# Altium schematic sheet Effects_Sch.SchDoc
size A
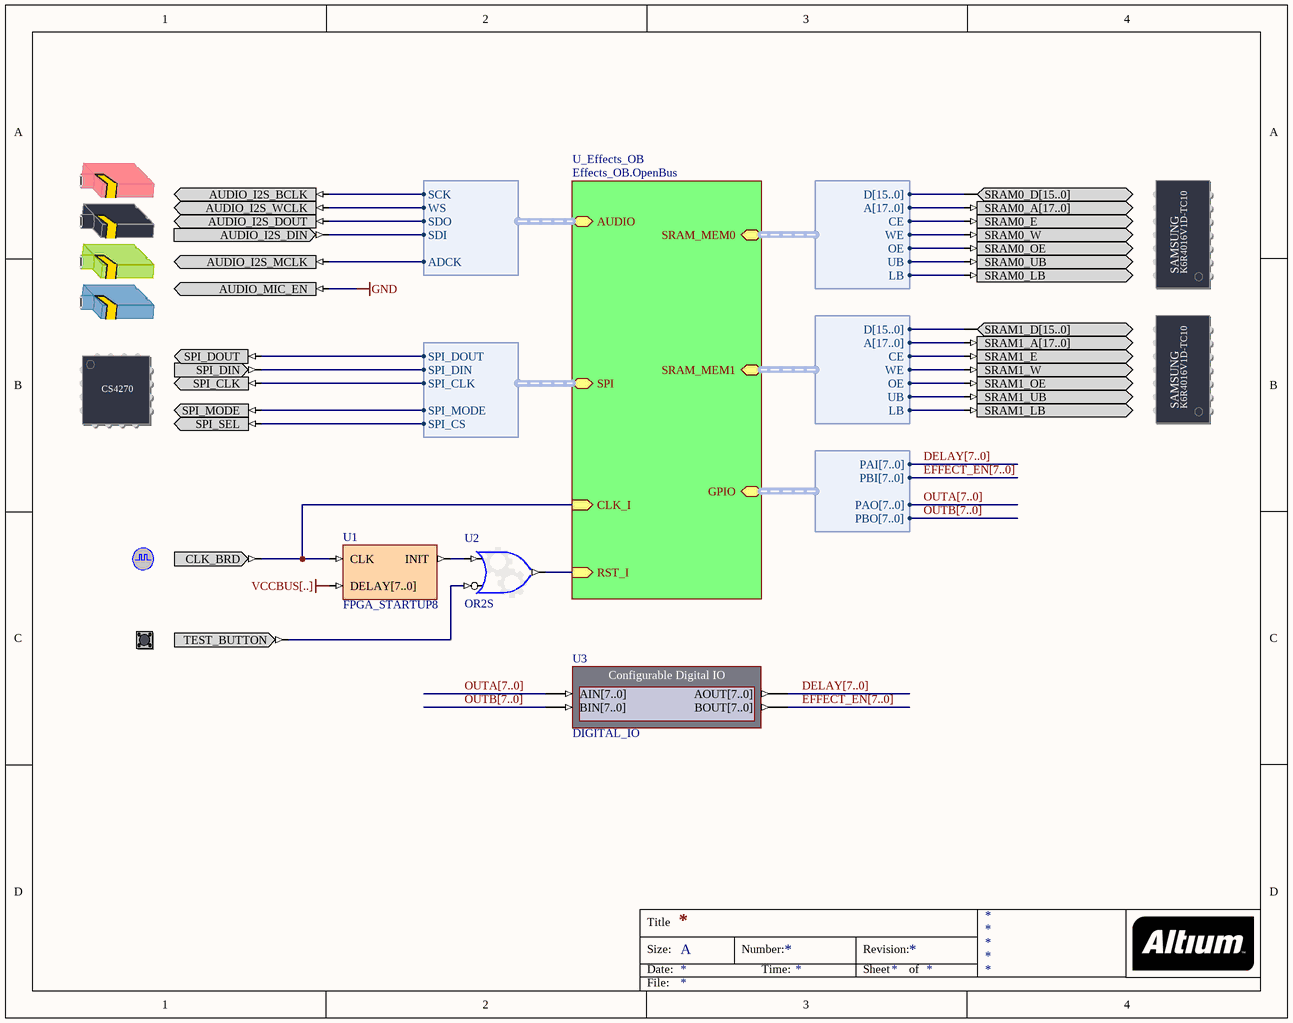
[diagram p0: Effects_Sch.SchDoc]

## Parts
(Parts that share a designator on the sheet are numbered #1, #2 ... from top to bottom, then left to right.)
?#1  AUDIO_CODEC  (value not drawn)
?#2  SRAM_DAUGHTER0  (value not drawn)
?#3  SRAM_DAUGHTER1  (value not drawn)
?#4  AUDIO_CODEC_CTRL  (value not drawn)
?#5  CLOCK_BOARD  (value not drawn)
?#6  TEST_BUTTON  (value not drawn)
U1  FPGA_STARTUP8
U2  OR2S
U3  DIGITAL_IO

## Sub-sheets
U_Effects_OB = Effects_OB.OpenBus: RST_I (in), CLK_I (in), GPIO (harness WB_PRTIO_IO_2_2), AUDIO (harness I2S_W_Both), SPI (harness SPI_W_NB), SRAM_MEM0 (harness WB_MEM_CTRL_SRAM16_A18), SRAM_MEM1 (harness WB_MEM_CTRL_SRAM16_A18)

## Harnesses
I2S_W_Both: SCK, WS, SDO, SDI, ADCK
SPI_W_NB: SPI_DOUT, SPI_DIN, SPI_CLK, SPI_MODE, SPI_CS
WB_PRTIO_IO_2_2: PAO[7..0], PAI[7..0], PBO[7..0], PBI[7..0]
WB_MEM_CTRL_SRAM16_A18: D[15..0], A[17..0], CE, WE, OE, UB, LB

## Nets
GND: ?#1.AUDIO_MIC_EN
VCCBUS[..]: U1.DELAY[7..0]
DELAY[7..0]: U3.AOUT[7..0] ; sheet U_Effects_OB/GPIO.PAI[7..0]
EFFECT_EN[7..0]: U3.BOUT[7..0] ; sheet U_Effects_OB/GPIO.PBI[7..0]
OUTA[7..0]: U3.AIN[7..0] ; sheet U_Effects_OB/GPIO.PAO[7..0]
OUTB[7..0]: U3.BIN[7..0] ; sheet U_Effects_OB/GPIO.PBO[7..0]
Net?#1_AUDIO_I2S_BCLK: ?#1.AUDIO_I2S_BCLK ; sheet U_Effects_OB/AUDIO.SCK
Net?#1_AUDIO_I2S_DIN: ?#1.AUDIO_I2S_DIN ; sheet U_Effects_OB/AUDIO.SDI
Net?#1_AUDIO_I2S_DOUT: ?#1.AUDIO_I2S_DOUT ; sheet U_Effects_OB/AUDIO.SDO
Net?#1_AUDIO_I2S_MCLK: ?#1.AUDIO_I2S_MCLK ; sheet U_Effects_OB/AUDIO.ADCK
Net?#1_AUDIO_I2S_WCLK: ?#1.AUDIO_I2S_WCLK ; sheet U_Effects_OB/AUDIO.WS
Net?#2_SRAM0_A[17..0]: ?#2.SRAM0_A[17..0] ; sheet U_Effects_OB/SRAM_MEM0.A[17..0]
Net?#2_SRAM0_D[15..0]: ?#2.SRAM0_D[15..0] ; sheet U_Effects_OB/SRAM_MEM0.D[15..0]
Net?#2_SRAM0_E: ?#2.SRAM0_E ; sheet U_Effects_OB/SRAM_MEM0.CE
Net?#2_SRAM0_LB: ?#2.SRAM0_LB ; sheet U_Effects_OB/SRAM_MEM0.LB
Net?#2_SRAM0_OE: ?#2.SRAM0_OE ; sheet U_Effects_OB/SRAM_MEM0.OE
Net?#2_SRAM0_UB: ?#2.SRAM0_UB ; sheet U_Effects_OB/SRAM_MEM0.UB
Net?#2_SRAM0_W: ?#2.SRAM0_W ; sheet U_Effects_OB/SRAM_MEM0.WE
Net?#3_SRAM1_A[17..0]: ?#3.SRAM1_A[17..0] ; sheet U_Effects_OB/SRAM_MEM1.A[17..0]
Net?#3_SRAM1_D[15..0]: ?#3.SRAM1_D[15..0] ; sheet U_Effects_OB/SRAM_MEM1.D[15..0]
Net?#3_SRAM1_E: ?#3.SRAM1_E ; sheet U_Effects_OB/SRAM_MEM1.CE
Net?#3_SRAM1_LB: ?#3.SRAM1_LB ; sheet U_Effects_OB/SRAM_MEM1.LB
Net?#3_SRAM1_OE: ?#3.SRAM1_OE ; sheet U_Effects_OB/SRAM_MEM1.OE
Net?#3_SRAM1_UB: ?#3.SRAM1_UB ; sheet U_Effects_OB/SRAM_MEM1.UB
Net?#3_SRAM1_W: ?#3.SRAM1_W ; sheet U_Effects_OB/SRAM_MEM1.WE
Net?#4_SPI_CLK: ?#4.SPI_CLK ; sheet U_Effects_OB/SPI.SPI_CLK
Net?#4_SPI_DIN: ?#4.SPI_DIN ; sheet U_Effects_OB/SPI.SPI_DIN
Net?#4_SPI_DOUT: ?#4.SPI_DOUT ; sheet U_Effects_OB/SPI.SPI_DOUT
Net?#4_SPI_MODE: ?#4.SPI_MODE ; sheet U_Effects_OB/SPI.SPI_MODE
Net?#4_SPI_SEL: ?#4.SPI_SEL ; sheet U_Effects_OB/SPI.SPI_CS
Net?#5_CLK_BRD: ?#5.CLK_BRD U1.CLK ; sheet U_Effects_OB/CLK_I
Net?#6_TEST_BUTTON: ?#6.TEST_BUTTON U2.I1
NetU1_INIT: U1.INIT U2.I0
NetU2_O: U2.O ; sheet U_Effects_OB/RST_I

## Buses and harness runs
bus DELAY[7..0]
bus EFFECT_EN[7..0]
bus OUTA[7..0]
bus OUTB[7..0]

## Notes on the sheet
- Title
- Size:
- Date:
- A
- Number:
- Time:
- Revision:
- Sheet
- of
- File:
- (in symbol AUDIO_CODEC_CTRL) CS4270
- (in symbol SRAM_DAUGHTER0) SAMSUNG; K6R4016V1D-TC10
- (in symbol SRAM_DAUGHTER1) SAMSUNG; K6R4016V1D-TC10

## Library data of the parts
?#1 = AUDIO_CODEC: Audio Codec; PortComponent: True; Published: 22-Jan-2007; Publisher: Altium Limited; HelpURL: TR0145 Technical Reference for Altium's Audio-Video Peripheral Board PB01.pdf#page=12
?#2 = SRAM_DAUGHTER0: Free Static RAM - Daughterboard; PortComponent: True; Published: 14-May-2007; Publisher: Altium Limited; HelpURL: TR0149 Technical Reference for Altium's Xilinx Spartan-3 Daughter Board DB30.pdf#page=16
?#3 = SRAM_DAUGHTER1: Free Static RAM - Daughterboard; PortComponent: True; Published: 14-May-2007; Publisher: Altium Limited; HelpURL: TR0149 Technical Reference for Altium's Xilinx Spartan-3 Daughter Board DB30.pdf#page=16
?#4 = AUDIO_CODEC_CTRL: Audio Codec Control; PortComponent: True; Published: 22-Jan-2007; Publisher: Altium Limited; HelpURL: TR0145 Technical Reference for Altium's Audio-Video Peripheral Board PB01.pdf#page=13
?#5 = CLOCK_BOARD: Global System Clock Supply; PortComponent: True; Published: 19-Nov-2003; Publisher: Altium Limited; HelpURL: TR0143 Technical Reference Manual for Altium's Desktop NanoBoard NB2DSK01.pdf#page=41; UseInDSF: True
?#6 = TEST_BUTTON: Test / Reset Button; PortComponent: True; Published: 19-Nov-2003; Publisher: Altium Limited; HelpURL: TR0143 Technical Reference Manual for Altium's Desktop NanoBoard NB2DSK01.pdf#page=53
U1 = FPGA_STARTUP8: FPGA Startup With 8 Bit Delay; Published: 9-Dec-2004; Publisher: Altium Limited; HelpURL: CR0119 FPGA_STARTUPx Powerup Delay Unit.pdf; LastRevisionNo: 1.00.00; ComponentLink1Description: Core &Resource Usage; ComponentLink1URL: CR0139 FPGA Peripheral Resource Usage.pdf#page=11
U2 = GATE: Configurable Generic Gate; ConfiguratorName: GENERIC_GATE; ConfigurationParameters: {}Version[1.0]{}GateKind[OR]{}BusInput[False]{}GateInputType[Bit]{}GateOutputOption[Normal]{}BusWidth[8]{}RegisterOutputs[False]{}NegativeClockEdge[False]{}InputCount[2]{}InputInvert0[False]{}InputInvert1[True]{}; LastRevisionNo: 1.00.00; Published: 3-Sep-2008; Publisher: Altium Limited
U3 = DIGITAL_IO: Configurable Digital IO; NEXUS_CORE: Instrument; NEXUS_JTAG_DEVICE: True; NEXUS_JTAG_ORDER: 0; ConfigurationParameters: {}Version[2.0]{}StorageType[3]{}InterfaceType[Parallel]{}SchCompWidth[140]{}Input0Name[AIN{1}7..0{2}]{}Input0Width[8]{}Input0InitValue[0]{}Input0Kind[Bar]{}Input0BarStyle[Red]{}Input1Name[BIN{1}7..0{2}]{}Input1Width[8]{}Input1InitValue[0]{}Input1Kind[LEDs]{}Input1LEDStyle[Red]{}Output0Name[AOUT{1}7..0{2}]{}Output0Width[8]{}Output0InitValue[0]{}Output0Kind[Slider]{}Output1Name[BOUT{1}7..0{2}]{}Output1Width[8]{}Output1InitValue[0]{}Output1Kind[LED Digits]{}Output1SegStyle[Red]{}Output1SegRadix[Binary]{}Designator[U3]{}InternalID[0]{}; ConfiguratorName: DIGITAL_IO; ComponentLink1Description: Core &Resource Usage; ComponentLink1URL: CR0134 FPGA Instrument Resource Usage.pdf; Core Revision: 1.00.00; HelpURL: CR0179 DIGITAL_IO Configurable Digital IO Module.pdf; LastRevisionNo: 1.00.00; Published: 28-Jun-2007; Publisher: Altium Limited; UseInDSF: True